# EAGLE schematic Meter_PCB_V1 (EAGLE 9.0.0)
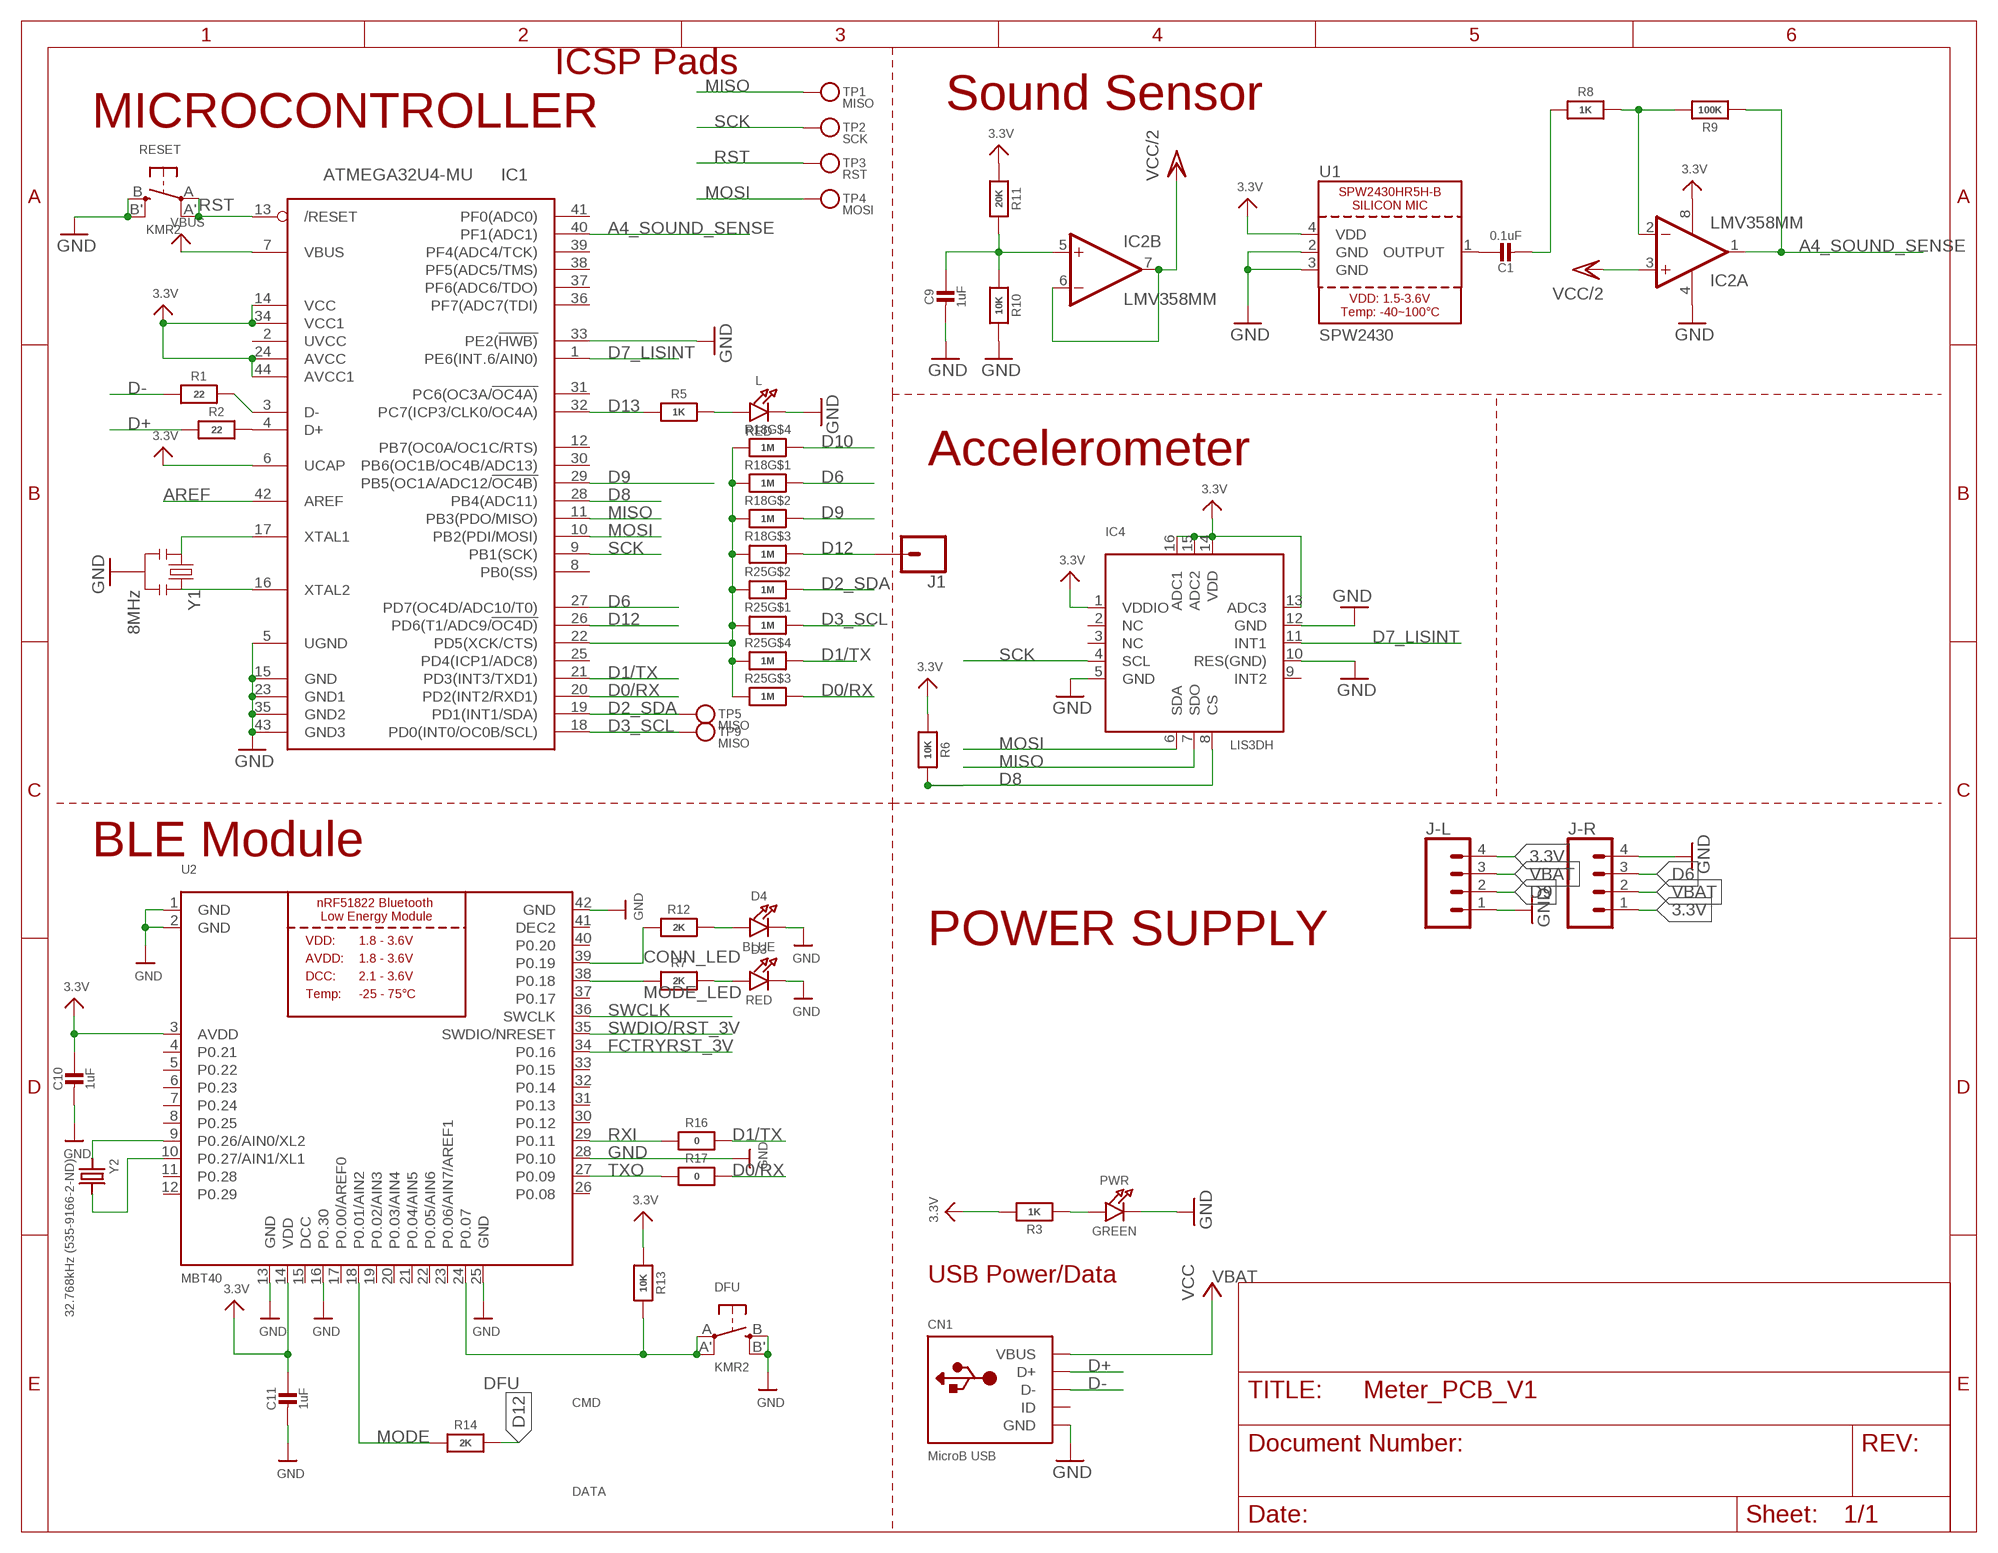
[diagram p0: schematic, sheet 1]

## Parts
C1  0.1uF  CAP_CERAMIC0603_NO  [0603-NO]
C9  1uF  CAP_CERAMIC0603_NO  [0603-NO]
C10  1uF  CAP_CERAMIC0805-NOOUTLINE  [0805-NO]
C11  1uF  CAP_CERAMIC0805-NOOUTLINE  [0805-NO]
CN1  MicroB USB  USB_MICRO_20329_V2  [4UCONN_20329_V2]
D3  RED  LED0805_NOOUTLINE  [CHIPLED_0805_NOOUTLINE]
D4  BLUE  LED0805_NOOUTLINE  [CHIPLED_0805_NOOUTLINE]
DFU  KMR2  SWITCH_TACT_SMT4.6X2.8  [BTN_KMR2_4.6X2.8]
IC1  ATMEGA32U4-MU  [TQFN44_7MM]
IC2  LMV358MM  [MSOP08]
IC4  LIS3DH  ACCEL_LIS3DHTR  [LGA16_3X3MM]
J1  CONN_01  [1X01]
J-L  CONN_04  [1X04]
J-R  CONN_04  [1X04]
L  RED  LED0805_NOOUTLINE  [CHIPLED_0805_NOOUTLINE]
PWR  GREEN  LED0805_NOOUTLINE  [CHIPLED_0805_NOOUTLINE]
R1  22  RESISTOR_0603_NOOUT  [0603-NO]
R2  22  RESISTOR_0603_NOOUT  [0603-NO]
R3  1K  RESISTOR_0603_NOOUT  [0603-NO]
R5  1K  RESISTOR_0603_NOOUT  [0603-NO]
R6  10K  RESISTOR_0603_NOOUT  [0603-NO]
R7  2K  RESISTOR0805_NOOUTLINE  [0805-NO]
R8  1K  RESISTOR_0603_NOOUT  [0603-NO]
R9  100K  RESISTOR_0603_NOOUT  [0603-NO]
R10  10K  RESISTOR_0603_NOOUT  [0603-NO]
R11  20K  RESISTOR_0603_NOOUT  [0603-NO]
R12  2K  RESISTOR0805_NOOUTLINE  [0805-NO]
R13  10K  RESISTOR0805_NOOUTLINE  [0805-NO]
R14  2K  RESISTOR0805_NOOUTLINE  [0805-NO]
R16  0  RESISTOR_0603_NOOUT  [0603-NO]
R17  0  RESISTOR_0603_NOOUT  [0603-NO]
R18  1M  RESISTOR_4PACK_NO  [RESPACK_4X0603_NO]
R25  1M  RESISTOR_4PACK_NO  [RESPACK_4X0603_NO]
RESET  KMR2  SWITCH_TACT_SMT4.6X2.8  [BTN_KMR2_4.6X2.8]
TP1  MISO  TESTPOINTROUND1.5MM  [TESTPOINT_ROUND_1.5MM]
TP2  SCK  TESTPOINTROUND1.5MM  [TESTPOINT_ROUND_1.5MM]
TP3  RST  TESTPOINTROUND1.5MM  [TESTPOINT_ROUND_1.5MM]
TP4  MOSI  TESTPOINTROUND1.5MM  [TESTPOINT_ROUND_1.5MM]
TP5  MISO  TESTPOINTROUND1.5MM  [TESTPOINT_ROUND_1.5MM]
TP9  MISO  TESTPOINTROUND1.5MM  [TESTPOINT_ROUND_1.5MM]
U1  SPW2430  SPW2430HR5H-B  [SPW2430HR5H-B]
U2  MBT40  NRF51822_MODULE_MDBT40  [BLE_MODULE_RAYTAC_MDBT40]
Y1  8MHz  RESONATORSMD  [RESONATOR-SMD]
Y2  32.768kHz (535-9166-2-ND)  CRYSTAL2.0X6.0_32.768  [CRYSTAL_CYL_2X6MM_SMT]

## Nets
3.3V: C10.1 C11.1 IC1.6(UCAP) IC1.14(VCC) IC1.24(AVCC) IC1.34(VCC1) IC1.44(AVCC1) IC2.8(P:V+) IC4.1(VDDIO) IC4.13(ADC3) IC4.14(VDD) IC4.15(ADC2) IC4.16(ADC1) J-L.4 J-R.1 R3.2 R6.1 R11.1 R13.1 U1.4(VDD) U2.3(AVDD) U2.14(VDD)
A4_SOUND_SENSE: IC1.40(PF1(ADC1)) IC2.1(A:OUT) R9.1
AREF: IC1.42(AREF)
CONN_LED: R12.1 U2.39(P0.19)
D0/RX: IC1.20(PD2(INT2/RXD1)) R17.2 R25.6
D1/TX: IC1.21(PD3(INT3/TXD1)) R16.2 R25.5
D2_SDA: IC1.19(PD1(INT1/SDA)) R25.7 TP5.P$1
D3_SCL: IC1.18(PD0(INT0/OC0B/SCL)) R25.8 TP9.P$1
D6: IC1.27(PD7(OC4D/ADC10/T0)) J-R.3 R18.8
D7_LISINT: IC1.1(PE6(INT.6/AIN0)) IC4.11(INT1)
D8: IC1.28(PB4(ADC11)) IC4.8(CS) R6.2
D9: IC1.29(PB5(OC1A/ADC12/!OC4B)) J-L.2 R18.7
D10: R18.5
D12: IC1.26(PD6(T1/ADC9/!OC4D)) R14.2 R18.6
D13: IC1.32(PC7(ICP3/CLK0/OC4A)) R5.1
D+: CN1.D+ R2.1
D-: CN1.D- R1.1
DFU: DFU.A'(P1) DFU.A(P) R13.2 U2.24(P0.07)
FCTRYRST_3V: U2.34(P0.16)
GND: C9.2 C10.2 C11.2 CN1.BASE@1(GND) CN1.BASE@2(GND) CN1.GND CN1.SPRT@1(GND) CN1.SPRT@2(GND) CN1.SPRT@3(GND) CN1.SPRT@4(GND) D3.C D4.C DFU.B'(S1) DFU.B(S) IC1.5(UGND) IC1.15(GND) IC1.23(GND1) IC1.33(PE2(!HWB)) IC1.35(GND2) IC1.43(GND3) IC2.4(P:V-) IC4.5(GND) IC4.10(RES(GND)) IC4.12(GND) J-L.1 J-R.4 L.C PWR.C R10.2 RESET.B'(S1) RESET.B(S) U1.2(GND) U1.3(GND) U2.1(GND) U2.2(GND) U2.13(GND) U2.16(P0.30) U2.25(GND) U2.28(P0.10) U2.42(GND) Y1.2
MISO: IC1.11(PB3(PDO/MISO)) IC4.7(SDO) TP1.P$1
MODE: R14.1 U2.18(P0.01/AIN2)
MODE_LED: R7.1 U2.38(P0.18)
MOSI: IC1.10(PB2(PDI/MOSI)) IC4.6(SDA) TP4.P$1
N$1: PWR.A R3.1
N$2: IC2.2(A:-IN) R8.2 R9.2
N$3: IC1.3(D-) R1.2
N$4: IC1.4(D+) R2.2
N$5: D3.A R7.2
N$6: C9.1 IC2.5(B:+IN) R10.1 R11.2
N$8: IC1.17(XTAL1) Y1.1
N$9: IC1.16(XTAL2) Y1.3
N$10: L.A R5.2
N$11: D4.A R12.2
N$12: U2.9(P0.26/AIN0/XL2) Y2.1
N$13: U2.10(P0.27/AIN1/XL1) Y2.2
N$15: C1.2 R8.1
RST: IC1.13(/RESET) RESET.A'(P1) RESET.A(P) TP3.P$1
RXI: R16.1 U2.29(P0.11)
SCK: IC1.9(PB1(SCK)) IC4.4(SCL) TP2.P$1
SOUNDOUT: C1.1 U1.1(OUTPUT)
SWCLK: U2.36(SWCLK)
SWDIO/RST_3V: U2.35(SWDIO/NRESET)
TXLED1: R18.1 R18.2 R18.3 R18.4 R25.1 R25.2 R25.3 R25.4
TXO: R17.1 U2.27(P0.09)
VBAT: CN1.VBUS J-L.3 J-R.2 ; supply symbol labelled VCC
VBUS: IC1.7(VBUS)
VCC/2: IC2.3(A:+IN) IC2.6(B:-IN) IC2.7(B:OUT)
Unconnected: CN1.ID IC1.2(UVCC) IC1.8(PB0(SS)) IC1.12(PB7(OC0A/OC1C/RTS)) IC1.22(PD5(XCK/CTS)) IC1.25(PD4(ICP1/ADC8)) IC1.30(PB6(OC1B/OC4B/ADC13)) IC1.31(PC6(OC3A/!OC4A)) IC1.36(PF7(ADC7(TDI)) IC1.37(PF6(ADC6/TDO)) IC1.38(PF5(ADC5/TMS)) IC1.39(PF4(ADC4/TCK)) IC1.41(PF0(ADC0)) IC4.2(NC) IC4.3(NC) IC4.9(INT2) J1.1 U2.4(P0.21) U2.5(P0.22) U2.6(P0.23) U2.7(P0.24) U2.8(P0.25) U2.11(P0.28) U2.12(P0.29) U2.17(P0.00/AREF0) U2.19(P0.02/AIN3) U2.20(P0.03/AIN4) U2.21(P0.04/AIN5) U2.22(P0.05/AIN6) U2.23(P0.06/AIN7/AREF1) U2.26(P0.08) U2.30(P0.12) U2.31(P0.13) U2.32(P0.14) U2.33(P0.15) U2.37(P0.17) U2.40(P0.20)

## Notes on the sheet
- ICSP Pads
- Sound Sensor
- MICROCONTROLLER
- Accelerometer
- BLE Module
- POWER SUPPLY
- USB Power/Data
- CMD
- DATA

## Power pins joined to a net without a drawn wire
DCC: U2.15(DCC)
DEC2: U2.41(DEC2)

## Library data of the parts
C1 C9-C11 = microbuilder:CAP_CERAMIC: Ceramic Capacitors For new designs, use the packages preceded by an '_' character since they are more reliable: The following footprints should be used on most boards: _0402 - Standard footprint for regular board layouts _0603 - Standard footprint for regular board layouts _0805 - Standard footprint for regular board layouts _1206 - Standard footprint for regular board layouts For extremely tight-pitch boards where space is at a premium, the following 'micro-pitch' footprints can be used (smaller pads, no silkscreen outline, etc.): _0402MP - Micro-pitch footprint for very dense/compact boards _0603MP - Micro-pitch footprint for very dense/compact boards _0805MP - Micro-pitch footprint for very dense/compact boards _1206MP - Micro-pitch footprint for very dense/compact boards
CN1 = microbuilder:USB: USB Connectors USBMINIB - Surface Mount Female Mini-B USB Connector 4UConnector: 06564
D3 D4 L PWR = microbuilder:LED: LED 0603 - 0603 Surface Mount Package 2mA: Green LED - Low Power (3.9mcd, 2ma, 1.7Vf) - Digikey: 475-2709-2-ND Orange LED - Low Power (9.8mcd, 2ma, 1.8Vf) - Digikey: 475-1194-2-ND Red LED - Low Power (5mcd, 2ma, 1.8Vf) - Digikey: 475-1195-2-ND Yellow LED - Low Power (7mcd, 2ma, 1.8Vf) - Digikey: 475-1196-2-ND 5mA: Blue LED - Low Power (17mcd, 5ma, 2.9Vf) - Digikey: LNJ937W8CRACT-ND 0805 - 0805 Surface Mount Package 2mA: Red LED (8.8mcd, 2mA, 1.8Vf, Clear) - Low Power [Digikey: 475-2510-1-ND] Green LED (5mcd, 2mA, 1.8Vf, Clear) - Low Power [Digikey: 475-2730-1-ND] Yellow LED (11.3mcd, 2mA, 1.8Vf, Clear) - Low Power [Digikey: 475-2555-1-ND] 20mA: Red LED (104mcd, 20mA, Diffused) - LS R976 [Digikey: 475-1278-6-ND] Red LED (12mcd, 20mA, 2.0Vf, Clear) - APT2012EC [Digikey: 754-1128-1-ND] Green LED (15mcd, 20mA, 2.2Vf, Clear) - APT2012GC [Digikey: 754-1131-1-ND] Orange LED (160mcd, 20mA, 2.1Vf, Clear) - APT2012SECK [Digikey: 754-1130-1-ND] 1206 - 1206 Surface Mount Package Green LED (26mcd, 20mA, Diffused) - LG N971 [Digikey: 475-1407-6-ND] Red LED (15mcd, 20mA, Diffused) - LH N974 [Digikey: 475-1416-6-ND] Cree - Cree High-Power Surface Mount LEDs XPEBWT-L1-0000-00D50 - White 111lm 350mA 2.9Vf 6200K 110° XTEAWT-00-0000-00000LEE3 - White 114lm 350mA 2.85Vf 5000K 115° Everlight - Everlight 45-21 Series Surface Mount LEDs 45-21/QK2C-B2832AC2CB2/2T - Warm White 2000mcd 20mA 3.25Vf 3050K 120° 45-21/LK2C-B38452C4CB2/2T - Nuetral White 2000mcd 20mA 3.25Vf 4150K 120° 45-21/LK2C-B50634C6CB2/2T - Cold White 2200mcd 20mA 3.25Vf 5650K 120° PLCC2 Reverse Mount LS T77K-J1L2-1-0-2-R18-Z - Red 11.25mcd 2mA 1.8Vf 630nm 120° LO T77K-L1M2-24-Z - Orange 19.6mcd 2mA 1.8Vf 606nm 120° LY T77K-K2M1-26-Z - Yellow 15.7mcd 2mA 1.8Vf 587nm 120°
DFU RESET = microbuilder:SWITCH_TACT_SMT: SMT Tact Switches 6x6mm - Digikey: P12940SCT-ND KMR2 (4.6x2.8mm) - Digikey: 401-1426-1-ND EVQ-PQHB55 - Light Touch, 160GF (4.5x4.5mm) - Digikey: P8090SCT-ND KMT0 - KMT021 NGJ LHS (etc.) IP68/Waterproof - Digikey: CKN10289CT-ND
IC1 = microbuilder:ATMEGA32U4: http://www.ladyada.net/library/eagle
IC2 = linear:LMV358?*: Dual General Purpose, Low Voltage, Rail-to-Rail Output Operational Amplifiers Source: http://www.national.com/mpf/LM/LMV321.html http://www.national.com/dt/lmv_qual.pdf
IC4 = microbuilder:ACCEL_LIS3DHTR: LIS3DHTR 3-Axis Accelerometer with I2C/SPI Interface VDD: 1.71-3.6V VDDIO: 1.71-VDD+0.1V Scale: +/-2g, 4g, 8g, 16g with 16--bit data output Temp:: -40°C - 85°C Mouser: 511-LIS3DHTR Digikey: 497-10613-1-ND
J1 = SparkFun-Connectors:CONN_01: Single connection point. Often used as Generic Header-pin footprint for 0.1 inch spaced/style header connections On any of the 0.1 inch spaced packages, you can populate with these: Break Away Headers - Straight <https://www.sparkfun.com/products/116> (PRT-00116) Break Away Male Headers - Right Angle <https://www.sparkfun.com/products/553> (PRT-00553) Female Headers <https://www.sparkfun.com/products/115> (PRT-00115) Break Away Headers - Machine Pin <https://www.sparkfun.com/products/117> (PRT-00117) Break Away Female Headers - Swiss Machine Pin <https://www.sparkfun.com/products/743> (PRT-00743) This device is also useful as a general connection point to wire up your design to another part of your project. Our various solder wires solder well into these plated through hole pads. Hook-Up Wire - Assortment (Stranded, 22 AWG) <https://www.sparkfun.com/products/11375> (PRT-11375) Hook-Up Wire - Assortment (Solid Core, 22 AWG) <https://www.sparkfun.com/products/11367> (PRT-11367) View the entire wire category on our website here <https://www.sparkfun.com/categories/141> Special notes: SMTSO-256-ET is a "flush mount" nut for a 4-40 screw. We mostly use this on specialty testbeds; it is a nice way to connect hardware to your PCB at an adjustable hieght. Also note, the SNAP packages are for using a snappable style connector. We sell a baggie of snaps and they are also used on two LilyPad designs: Snap Assortment - 30 pack (male and female) <https://www.sparkfun.com/products/11347> (DEV-11347) LilyPad Arduino SimpleSnap <https://www.sparkfun.com/products/10941> (DEV-10941) LilyPad SimpleSnap Protoboard <https://www.sparkfun.com/products/10940> (DEV-10940)
J-L J-R = SparkFun-Connectors:CONN_04: Multi connection point. Often used as Generic Header-pin footprint for 0.1 inch spaced/style header connections On any of the 0.1 inch spaced packages, you can populate with these: Break Away Headers - Straight <https://www.sparkfun.com/products/116> (PRT-00116) Break Away Male Headers - Right Angle <https://www.sparkfun.com/products/553> (PRT-00553) Female Headers <https://www.sparkfun.com/products/115> (PRT-00115) Break Away Headers - Machine Pin <https://www.sparkfun.com/products/117> (PRT-00117) Break Away Female Headers - Swiss Machine Pin <https://www.sparkfun.com/products/743> (PRT-00743) For SCREWTERMINALS and SPRING TERMINALS visit here: Screw Terimnals on SparkFun.com <https://www.sparkfun.com/search/results?term=Screw+Terminals> (5mm/3.5mm/2.54mm spacing) This device is also useful as a general connection point to wire up your design to another part of your project. Our various solder wires solder well into these plated through hole pads. Hook-Up Wire - Assortment (Stranded, 22 AWG) <https://www.sparkfun.com/products/11375> (PRT-11375) Hook-Up Wire - Assortment (Solid Core, 22 AWG) <https://www.sparkfun.com/products/11367> (PRT-11367) View the entire wire category on our website here <https://www.sparkfun.com/categories/141> Special notes: Molex polarized connector foot print use with SKU : PRT-08231 with associated crimp pins and housings. 1MM SMD Version SKU: PRT-10208; PROD_ID: CONN-09696
R1-R3 R5-R14 R16 R17 = microbuilder:RESISTOR: Resistors For new designs, use the packages preceded by an '_' character since they are more reliable: The following footprints should be used on most boards: _0402 - Standard footprint for regular board layouts _0603 - Standard footprint for regular board layouts _0805 - Standard footprint for regular board layouts _1206 - Standard footprint for regular board layouts For extremely tight-pitch boards where space is at a premium, the following 'micro-pitch' footprints can be used (smaller pads, no silkscreen outline, etc.): _0402MP - Micro-pitch footprint for very dense/compact boards _0603MP - Micro-pitch footprint for very dense/compact boards _0805MP - Micro-pitch footprint for very dense/compact boards _1206MP - Micro-pitch footprint for very dense/compact boards
R18 R25 = microbuilder:RESISTOR_4PACK: Resistor Packs (4 resistors) 4 x 0603 10K 1/16W - Digikey: YC164J-10KCT-ND
TP1-TP5 TP9 = microbuilder:TESTPOINT: Test Point Various test points for characterisation and PCB testing TESTPOINT_SMT - Compact Surface Mount Test Point [Digikey: 5016KTR-ND]
U1 = microbuilder:SPW2430HR5H-B: SPW2430HR5H-B - Silicon Microphone
U2 = microbuilder:NRF51822_MODULE_MDBT40: nRF51822 Bluetooth Low Energy Module
Y1 = SparkFun:RESONATOR: Resonator Small SMD resonator. This is the itty bitty 10/20MHz resonators with built in caps. CSTCE10M0G55 and CSTCE20M0V53. Footprint has been reviewed closely but hasn't been tested yet.
Y2 = microbuilder:CRYSTAL: Crystals HC49UP - Surface Mount Crystal 4.0MHz 18pF +/-30ppm Surface Mount Crystal [Digikey: 535-9857-1-ND] 12.0 MHz Surface Mount Crystal [Digikey: 535-9869-6-ND] 25.0 MHz Surface Mount Crystal [Digikey: 535-9078-1-ND] 2.5 x 2.0mm - MEMs SMT Crystal 16.0 MHz 10pF 20ppm 2.5 x 2.0mm Crystal [Digikey -40-85°C: 535-10923-1-ND] 3.2 x 2.5mm - MEMs SMT Crystal 12.0 MHz 8pF 15ppm 3.2 x 2.5mm Crystal [Digikey: -10-70°C: 644-1047-1-ND -40-125°C: 644-1128-1-ND] 40~85°C cheaper: 644-1173-6-ND 16.0 MHz 8pF 15ppm 3.2 x 2.5mm Crystal [Digikey: -10-70°C: 644-1049-1-ND -40-125°C: 644-1129-2-ND]-40~85°C cheaper: 644-1175-6-ND 16.0 MHz 10pF 10ppm 3.2 x 2.5mm Crystal [Digikey: 644-1100-1-ND] 27.12 MHz 18pF 30ppm 3.2 x 2.5mm Crystal [Digikey: 887-1424-1-ND] 27.12MHz 10pF 10ppm 3.2 x 2.5mm Crystal [Digikey: 887-1329-1-ND] 4.9 x 1.8mm - MEMs SMT Crystal 32.768 KHz 12.5pF 20ppm 4.9 x 1.8mm Crystal [Digikey: SE2415CT-ND] 8.0 x 3.8mm - Surface Mount Crystal 32.768kHz 12.5pF 20ppm -40°C-85°C [Digikey: 535-9166-2-ND] Cylinder 32.768KHz Cylinder Crystal (2x6mm body) [Ex. Digikey: 300-8341-2-ND]